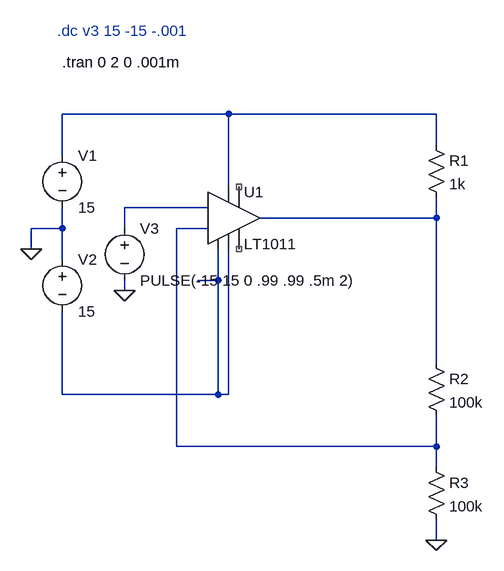
[diagram p0: schematic comparadorLt1011.asc]
comparadorLt1011.asc, the LTspice schematic file:
Version 4
SHEET 1 880 680
WIRE 192 0 -64 0
WIRE 512 0 192 0
WIRE 512 48 512 0
WIRE -64 64 -64 0
WIRE 192 112 192 0
WIRE 160 144 32 144
WIRE 512 160 512 128
WIRE 512 160 240 160
WIRE -64 176 -64 144
WIRE -64 176 -112 176
WIRE 32 176 32 144
WIRE 160 176 112 176
WIRE -112 208 -112 176
WIRE -64 224 -64 176
WIRE 176 256 176 208
WIRE 176 256 144 256
WIRE 32 272 32 256
WIRE 512 384 512 160
WIRE -64 432 -64 304
WIRE 176 432 176 256
WIRE 176 432 -64 432
WIRE 192 432 192 208
WIRE 192 432 176 432
WIRE 112 512 112 176
WIRE 512 512 512 464
WIRE 512 512 112 512
WIRE 512 544 512 512
WIRE 512 656 512 624
FLAG -112 208 0
FLAG 32 272 0
FLAG 512 656 0
SYMBOL Comparators\\LT1011 192 160 R0
SYMATTR InstName U1
SYMBOL voltage -64 48 R0
WINDOW 123 0 0 Left 0
WINDOW 39 0 0 Left 0
SYMATTR InstName V1
SYMATTR Value 15
SYMBOL voltage -64 208 R0
WINDOW 123 0 0 Left 0
WINDOW 39 0 0 Left 0
SYMATTR InstName V2
SYMATTR Value 15
SYMBOL voltage 32 160 R0
WINDOW 123 0 0 Left 0
WINDOW 39 0 0 Left 0
SYMATTR InstName V3
SYMATTR Value PULSE(-15 15 0 .99 .99 .5m 2)
SYMBOL res 496 32 R0
SYMATTR InstName R1
SYMATTR Value 1k
SYMBOL res 496 368 R0
SYMATTR InstName R2
SYMATTR Value 100k
SYMBOL res 496 528 R0
SYMATTR InstName R3
SYMATTR Value 100k
TEXT -64 -80 Left 2 !.tran 0 2 0 .001m
TEXT -72 -128 Left 2 ;.dc v3 15 -15 -.001

The netlist it stands for:
* comparadorLt1011.asc
XU1 N005 N004 N002 N005 NC_01 NC_02 N003 N001 LT1011
V1 N001 0 15
V2 0 N005 15
V3 N002 0 PULSE(-15 15 0 .99 .99 .5m 2)
R1 N001 N003 1k
R2 N003 N004 100k
R3 N004 0 100k
.tran 0 2 0 .001m
* .dc v3 15 -15 -.001
.lib LTC1.lib
.backanno
.end